# Altium schematic sheet 04_ZYNQ_BANK13_33_34.SchDoc
size A4; SheetNumber: 5; SheetTotal: 11
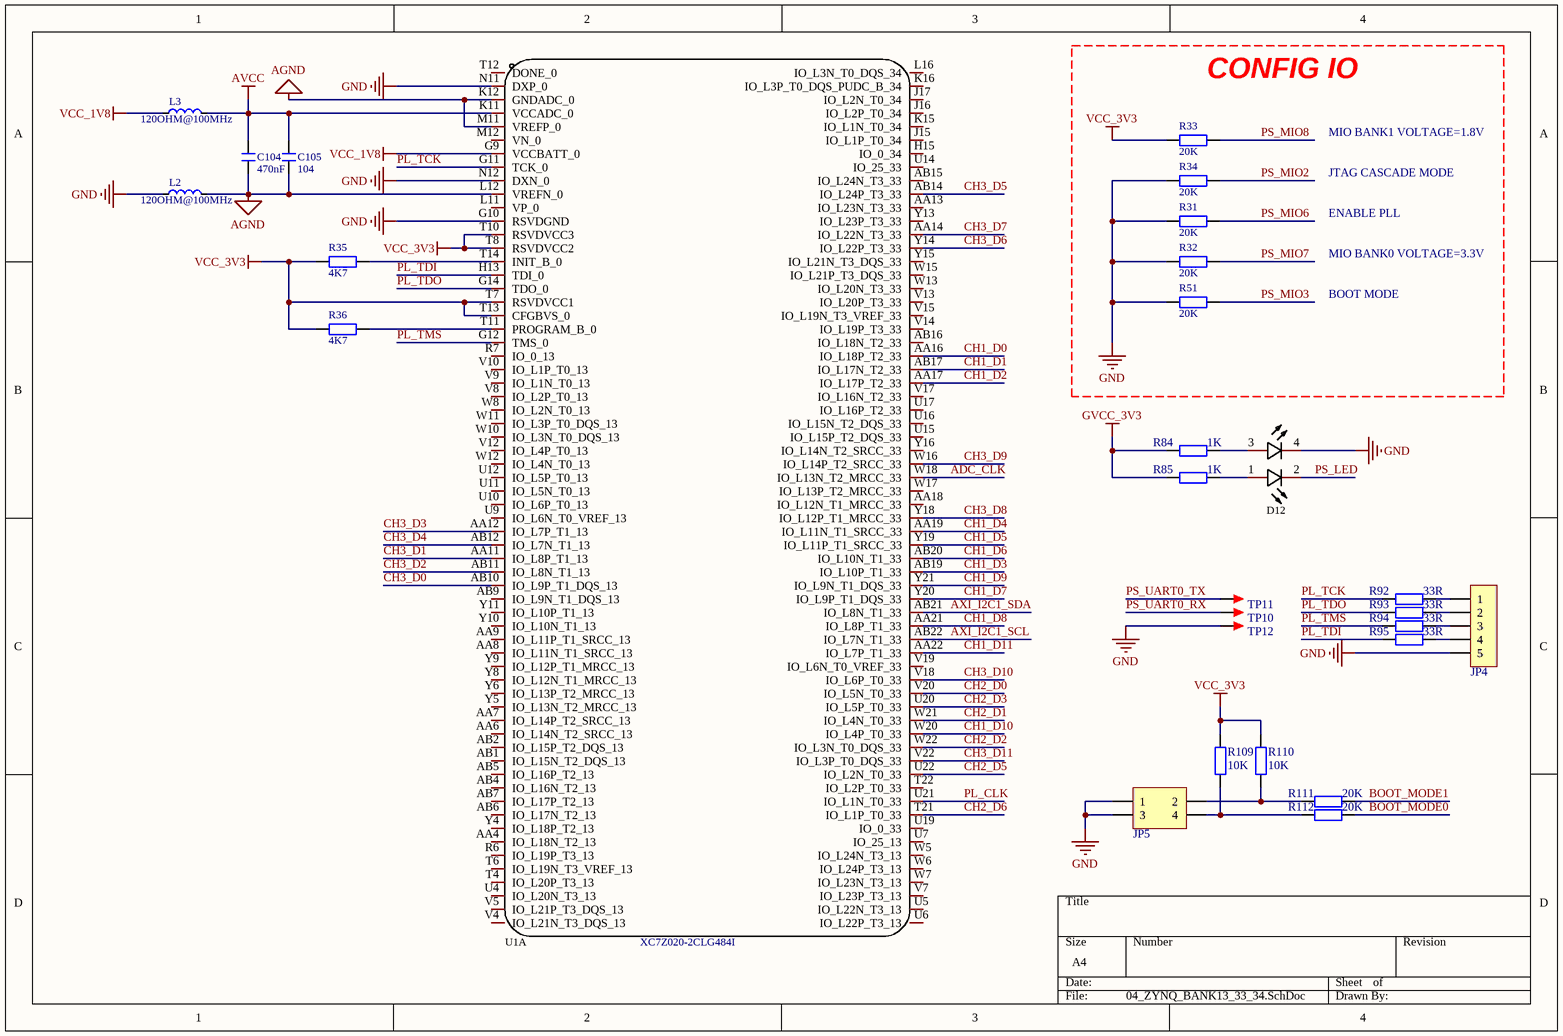
[diagram p0: 04_ZYNQ_BANK13_33_34.SchDoc]

## Parts
C104  470nF  [C 0402]
C105  104  [C 0402]
D12  A694B/2SYG/S530-E2  [Dual-LED]  (value not drawn)
JP4  HDR-1X5  [XH2.54-LI-5P]  (value not drawn)
JP5  Header2X2  [HDR2.54-LI-2x2P]  (value not drawn)
L2  120OHM@100MHz  [L 0603]
L3  120OHM@100MHz  [L 0603]
R31  20K  [R 0402]
R32  20K  [R 0402]
R33  20K  [R 0402]
R34  20K  [R 0402]
R35  4K7  [R 0402]
R36  4K7  [R 0402]
R51  20K  [R 0402]
R84  1K  [R 0603]
R85  1K  [R 0603]
R92  33R  [R 0603]
R93  33R  [R 0603]
R94  33R  [R 0603]
R95  33R  [R 0603]
R109  10K  [R 0603]
R110  10K  [R 0603]
R111  20K  [R 0603]
R112  20K  [R 0603]
TP10  TEST  [TEST 1]  (value not drawn)
TP11  TEST  [TEST 1]  (value not drawn)
TP12  TEST  [TEST 1]  (value not drawn)
U1  XC7Z020-2CLG484I  [FPBGA-484_L19.0-W19.0-R22-C22-P0.80-BL]  (part A of 4)

## Nets
AGND: C104.1 C105.1 L2.2 U1.K12(GNDADC_0) U1.L12(VREFN_0) U1.M11(VREFP_0)
AVCC: C104.2 C105.2 L3.2 U1.K11(VCCADC_0)
GND: D12.4(K2) JP4.5 JP5.1 JP5.3 L2.1 R31.1 R32.1 R34.1 R51.1 TP12.1 U1.G10(RSVDGND) U1.N11(DXP_0) U1.N12(DXN_0)
GVCC_3V3: R84.1 R85.1
VCC_1V8: L3.1 U1.G9(VCCBATT_0)
VCC_3V3: R33.1 R35.1 R36.1 R109.1 R110.1 U1.T7(RSVDVCC1) U1.T8(RSVDVCC2) U1.T10(RSVDVCC3) U1.T13(CFGBVS_0)
ADC_CLK: U1.W18(IO_L13N_T2_MRCC_33)
AXI_I2C1_SCL: U1.AB22(IO_L7N_T1_33)
AXI_I2C1_SDA: U1.AB21(IO_L8N_T1_33)
BOOT_MODE0: R112.1
BOOT_MODE1: R111.1
CH1_D0: U1.AA16(IO_L18P_T2_33)
CH1_D1: U1.AB17(IO_L17N_T2_33)
CH1_D2: U1.AA17(IO_L17P_T2_33)
CH1_D3: U1.AB19(IO_L10P_T1_33)
CH1_D4: U1.AA19(IO_L11N_T1_SRCC_33)
CH1_D5: U1.Y19(IO_L11P_T1_SRCC_33)
CH1_D6: U1.AB20(IO_L10N_T1_33)
CH1_D7: U1.Y20(IO_L9P_T1_DQS_33)
CH1_D8: U1.AA21(IO_L8P_T1_33)
CH1_D9: U1.Y21(IO_L9N_T1_DQS_33)
CH1_D10: U1.W20(IO_L4P_T0_33)
CH1_D11: U1.AA22(IO_L7P_T1_33)
CH2_D0: U1.V20(IO_L5N_T0_33)
CH2_D1: U1.W21(IO_L4N_T0_33)
CH2_D2: U1.W22(IO_L3N_T0_DQS_33)
CH2_D3: U1.U20(IO_L5P_T0_33)
CH2_D5: U1.U22(IO_L2N_T0_33)
CH2_D6: U1.T21(IO_L1P_T0_33)
CH3_D0: U1.AB10(IO_L9P_T1_DQS_13)
CH3_D1: U1.AA11(IO_L8P_T1_13)
CH3_D2: U1.AB11(IO_L8N_T1_13)
CH3_D3: U1.AA12(IO_L7P_T1_13)
CH3_D4: U1.AB12(IO_L7N_T1_13)
CH3_D5: U1.AB14(IO_L24P_T3_33)
CH3_D6: U1.Y14(IO_L22P_T3_33)
CH3_D7: U1.AA14(IO_L22N_T3_33)
CH3_D8: U1.Y18(IO_L12P_T1_MRCC_33)
CH3_D9: U1.W16(IO_L14P_T2_SRCC_33)
CH3_D10: U1.V18(IO_L6P_T0_33)
CH3_D11: U1.V22(IO_L3P_T0_DQS_33)
PL_CLK: U1.U21(IO_L1N_T0_33)
PL_TCK: R92.1 U1.G11(TCK_0)
PL_TDI: R95.1 U1.H13(TDI_0)
PL_TDO: R93.1 U1.G14(TDO_0)
PL_TMS: R94.1 U1.G12(TMS_0)
PS_LED: D12.2(K1)
PS_MIO2: R34.2
PS_MIO3: R51.2
PS_MIO6: R31.2
PS_MIO7: R32.2
PS_MIO8: R33.2
PS_UART0_RX: TP10.1
PS_UART0_TX: TP11.1
NetD12_1: D12.1(A1) R85.2
NetD12_3: D12.3(A2) R84.2
NetJP4_1: JP4.1 R92.2
NetJP4_2: JP4.2 R93.2
NetJP4_3: JP4.3 R94.2
NetJP4_4: JP4.4 R95.2
NetJP5_2: JP5.2 R110.2 R111.2
NetJP5_4: JP5.4 R109.2 R112.2
NetR35_2: R35.2 U1.T14(INIT_B_0)
NetR36_2: R36.2 U1.T11(PROGRAM_B_0)

Not connected (* = marked no-connect by the designer): U1 AA4(IO_L18N_T2_13) AA6(IO_L14N_T2_SRCC_13) AA7(IO_L14P_T2_SRCC_13) AA8(IO_L11N_T1_SRCC_13) AA9(IO_L11P_T1_SRCC_13) AA13(IO_L23N_T3_33) AA18(IO_L12N_T1_MRCC_33) AB1(IO_L15N_T2_DQS_13) AB2(IO_L15P_T2_DQS_13) AB4(IO_L16N_T2_13) AB5(IO_L16P_T2_13) AB6(IO_L17N_T2_13) AB7(IO_L17P_T2_13) AB9(IO_L9N_T1_DQS_13) AB15(IO_L24N_T3_33) AB16(IO_L18N_T2_33) H15(IO_0_34) J15(IO_L1P_T0_34) J16(IO_L2P_T0_34) J17(IO_L2N_T0_34) K15(IO_L1N_T0_34) K16(IO_L3P_T0_DQS_PUDC_B_34) L11(VP_0) L16(IO_L3N_T0_DQS_34) M12(VN_0) R6(IO_L19P_T3_13) R7(IO_0_13) T4(IO_L20P_T3_13) T6(IO_L19N_T3_VREF_13) T12(DONE_0) T22(IO_L2P_T0_33) U4(IO_L20N_T3_13) U5(IO_L22N_T3_13) U6(IO_L22P_T3_13) U7(IO_25_13) U9(IO_L6N_T0_VREF_13) U10(IO_L6P_T0_13) U11(IO_L5N_T0_13) U12(IO_L5P_T0_13) U14(IO_25_33) U15(IO_L15P_T2_DQS_33) U16(IO_L15N_T2_DQS_33) U17(IO_L16P_T2_33) U19(IO_0_33) V4(IO_L21N_T3_DQS_13) V5(IO_L21P_T3_DQS_13) V7(IO_L23P_T3_13) V8(IO_L2P_T0_13) V9(IO_L1N_T0_13) V10(IO_L1P_T0_13) V12(IO_L4P_T0_13) V13(IO_L20P_T3_33) V14(IO_L19P_T3_33) V15(IO_L19N_T3_VREF_33) V17(IO_L16N_T2_33) V19(IO_L6N_T0_VREF_33) W5(IO_L24N_T3_13) W6(IO_L24P_T3_13) W7(IO_L23N_T3_13) W8(IO_L2N_T0_13) W10(IO_L3N_T0_DQS_13) W11(IO_L3P_T0_DQS_13) W12(IO_L4N_T0_13) W13(IO_L20N_T3_33) W15(IO_L21P_T3_DQS_33) W17(IO_L13P_T2_MRCC_33) Y4(IO_L18P_T2_13) Y5(IO_L13N_T2_MRCC_13) Y6(IO_L13P_T2_MRCC_13) Y8(IO_L12N_T1_MRCC_13) Y9(IO_L12P_T1_MRCC_13) Y10(IO_L10N_T1_13) Y11(IO_L10P_T1_13) Y13(IO_L23P_T3_33) Y15(IO_L21N_T3_DQS_33) Y16(IO_L14N_T2_SRCC_33)

## Notes on the sheet
- CONFIG IO
- MIO BANK1 VOLTAGE=1.8V
- JTAG CASCADE MODE
- ENABLE PLL
- MIO BANK0 VOLTAGE=3.3V
- BOOT MODE

## Library data of the parts
C104 C105 = C: 无极性贴片电容; 版权归属: 源创客; BOM名称: 无极性贴片电容; 学习资源: www.ooocke.com
D12 = A694B/2SYG/S530-E2: Manufacturer: EVERLIGHT(亿光); Add into BOM: yes; Emitted Color: 普绿/黄绿; Lens Color: 绿色; Dominant Wavelength: 573nm; Peak Wavelength: 575nm; Forward Current: 25mA; Power Dissipation: 60mW; Lamp Holder Type: 组装式圆形灯头; Name: A694B/2SYG/S530-E2; Symbol: A694B/2SYG/S530-E2; Device: A694B/2SYG/S530-E2; LCSC Part Name: A694B/2SYG/S530-E2; Supplier Part: C93880; Manufacturer Part: A694B/2SYG/S530-E2; Supplier Footprint: 插件; JLCPCB Part Class: Extended Part; Datasheet: https://atta.szlcsc.com/upload/public/pdf/source/20170116/1484561287996.pdf; Supplier: LCSC; Convert to PCB: yes; Diode Configuration: -; Color Temperature: -; Viewing Angle: -; Mounting Sytle: -; Operating Temperature: -40℃~+85℃
JP4 = Header 5: 5P接插件; 版权归属: 源创客; BOM名称: 5P接插件; 学习资源: www.ooocke.com
JP5 = Header 2X2: 2*2P接插件; 版权归属: 源创客; BOM名称: 2*2P接插件; 学习资源: www.ooocke.com
L2 L3 = L: 小功率贴片电感磁珠; 版权归属: 源创客; BOM名称: 小功率贴片电感; 学习资源: www.ooocke.com
R31-R36 R51 R84 R85 R92-R95 R109-R112 = R: 贴片电阻; 版权归属: 源创客; BOM名称: 贴片电阻; 学习资源: www.ooocke.com
TP10-TP12 = TEST: 测试点; 版权归属: 源创客; BOM名称: 测试点; 学习资源: www.ooocke.com
U1 = XC7Z020-2CLG484I: Manufacturer: XILINX(赛灵思); Add into BOM: yes; Paste Type: expand; Name: XC7Z020-2CLG484I; Symbol: XC7Z020-2CLG484I; Device: XC7Z020-2CLG484I; LCSC Part Name: XC7Z020-2CLG484I; Supplier Part: C157624; Manufacturer Part: XC7Z020-2CLG484I; Supplier Footprint: CSPBGA-484; JLCPCB Part Class: Extended Part; Datasheet: https://atta.szlcsc.com/upload/public/pdf/source/20180115/C157624_15160149665121269420.pdf; Supplier: LCSC; Convert to PCB: yes; Assembly Type: smtWeld